# EasyEDA schematic SCH_μAtlas_2026-06-21.json
TITLE: PWR Management; REV: 1.0; Date: 2026-06-20; Sheet: 1/1; Drawn By: httperry; Company: HackClub - Macondo
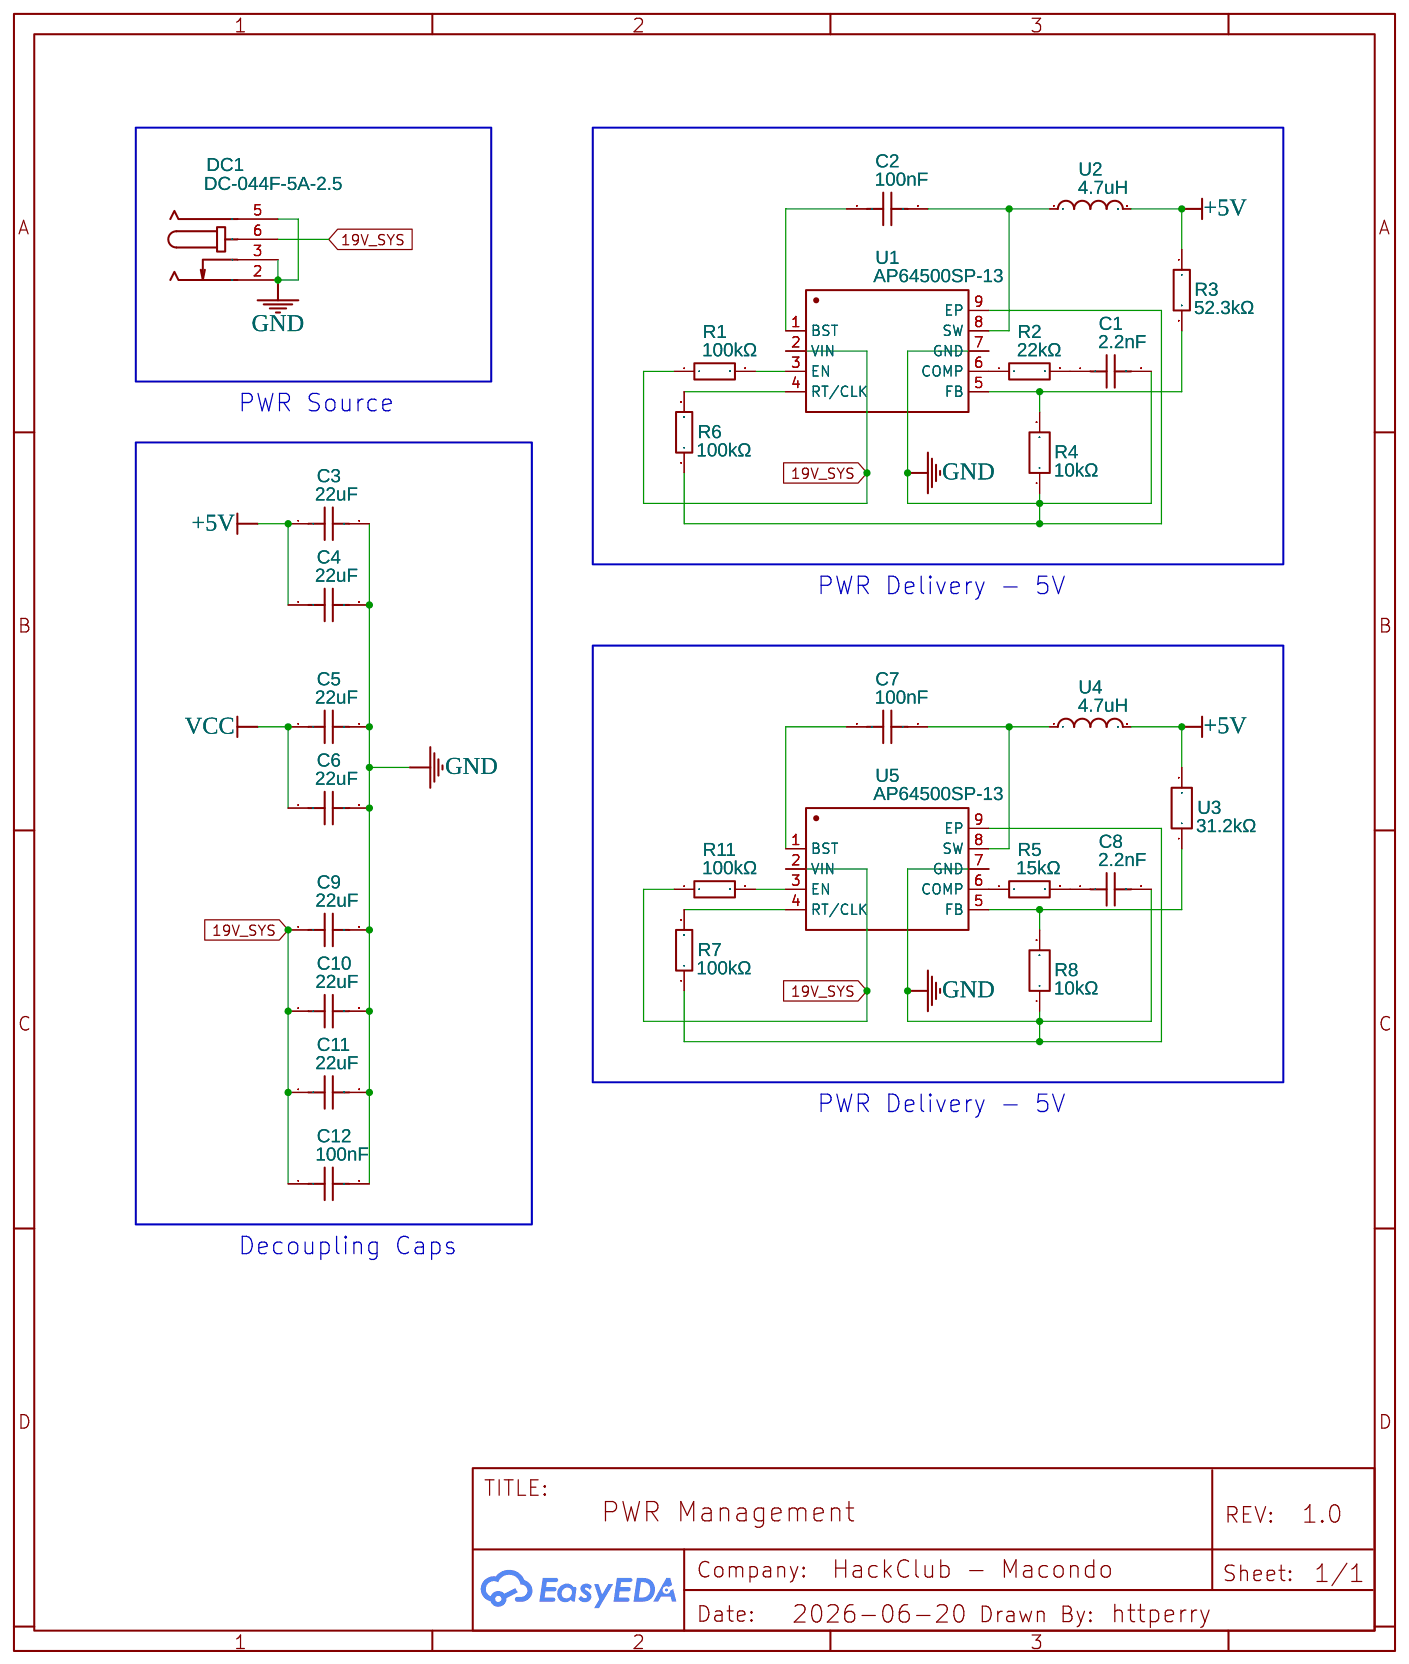
[diagram p0: schematic sheet]

## Parts
C1  2.2nF  [C0603]
C2  100nF  [C0603]
C3  22uF  [C0603]
C4  22uF  [C0603]
C5  22uF  [C0603]
C6  22uF  [C0603]
C7  100nF  [C0603]
C8  2.2nF  [C0603]
C9  22uF  [CAP-SMD_L6.1-W5.3-L]
C10  22uF  [CAP-SMD_L6.1-W5.3-L]
C11  22uF  [CAP-SMD_L6.1-W5.3-L]
C12  100nF  [C0603]
DC1  DC-044F-5A-2.5  [DC-IN-TH_DC-044F-5A-2.5]
R1  100kΩ  [R0603]
R2  22kΩ  [R0603]
R3  52.3kΩ  [R0603]
R4  10kΩ  [R0603]
R5  15kΩ  [R0603]
R6  100kΩ  [R0603]
R7  100kΩ  [R0603]
R8  10kΩ  [R0603]
R11  100kΩ  [R0603]
U1  AP64500SP-13  [SO-8_L4.9-W3.9-P1.27-LS6.0-BL-EP]
U2  4.7uH  [IND-SMD_L7.0-W6.6_APH0630]
U3  31.2kΩ  [R0603]
U4  4.7uH  [IND-SMD_L7.0-W6.6_APH0630]
U5  AP64500SP-13  [SO-8_L4.9-W3.9-P1.27-LS6.0-BL-EP]

## Library data of the parts
C1 C8 = FCC0603B222K500CT: Supplier: LCSC; Supplier Part: C5137562; Manufacturer: FOJAN(富捷); Contributor: lcsc; JLCPCB Part Class: Extended Part
C2 C7 C12 = GRM188R71H104KA93D: Supplier: LCSC; Manufacturer: muRata(村田); Supplier Part: C77055; JLCPCB Part Class: Extended Part
C3-C6 = HGC0603R5226M160NTHJ: Supplier: LCSC; Supplier Part: C22367828; Manufacturer: Chinocera(华瓷); JLCPCB Part Class: Extended Part; Contributor: lcsc
C9-C11 = KCM55QR71H226KH13K: Supplier: LCSC; Supplier Part: C6579204; Manufacturer: muRata(村田); JLCPCB Part Class: Extended Part; Contributor: lcsc
DC1 = DC-044F-5A-2.5: Supplier: LCSC; Supplier Part: C779941; Manufacturer: XKB Connection(中国星坤); JLCPCB Part Class: Extended Part; Contributor: lcsc
R1 R6 R7 R11 = RS-03K1003FT_C115320: Contributor: LCSC; Supplier: LCSC; Manufacturer: FH(风华); Manufacturer Part: RS-03K1003FT; Supplier Part: C115320; JLCPCB Part Class: Extended Part
R2 = RS-03K2202FT: Contributor: LCSC; Supplier: LCSC; Supplier Part: C286577; Manufacturer: FH(风华); JLCPCB Part Class: Extended Part
R3 = RS-03K5232FT: Contributor: LCSC; Supplier: LCSC; Supplier Part: C304764; Manufacturer: FH(风华); JLCPCB Part Class: Extended Part
R4 R8 = AR03BTS1002: Supplier: LCSC; Supplier Part: C20607729; Manufacturer: Viking(光颉); JLCPCB Part Class: Extended Part; Contributor: lcsc
R5 = CR0603FA1502G: Supplier: LCSC; Manufacturer: LIZ(丽智电子); Supplier Part: C100780; JLCPCB Part Class: Extended Part
U1 U5 = AP64500SP-13: Contributor: LCSC; Supplier: LCSC; Supplier Part: C2070920; Manufacturer: DIODES(美台); JLCPCB Part Class: Extended Part
U2 U4 = APH0630T4R7M: Supplier: LCSC; Supplier Part: C5349705; Manufacturer: APV(爱普微); JLCPCB Part Class: Extended Part; Contributor: lcsc
U3 = RT0603DRE0731K2L: Supplier: LCSC; Supplier Part: C863036; Manufacturer: YAGEO(国巨); JLCPCB Part Class: Extended Part; Contributor: lcsc

## Nets
19V_SYS: C9.1 C10.1 C11.1 C12.1 DC1.6 R1.1 R11.1 U1.2(VIN) U5.2(VIN)
+5V: C3.1 C4.1 R3.1 U2.2 U3.2 U4.2
GND: C1.2 C3.2 C4.2 C5.2 C6.2 C8.2 C9.2 C10.2 C11.2 C12.2 DC1.2 DC1.3 DC1.5 R4.1 R6.1 R7.1 R8.1 U1.7(GND) U1.9(EP) U5.7(GND) U5.9(EP)
VCC: C5.1 C6.1
Net-(C1-1): C1.1 R2.2
Net-(C2-1): C2.1 U1.1(BST)
Net-(C2-2): C2.2 U1.8(SW) U2.1
Net-(C7-1): C7.1 U5.1(BST)
Net-(C7-2): C7.2 U4.1 U5.8(SW)
Net-(C8-1): C8.1 R5.2
Net-(R1-2): R1.2 U1.3(EN)
Net-(R2-1): R2.1 U1.6(COMP)
Net-(R3-2): R3.2 R4.2 U1.5(FB)
Net-(R5-1): R5.1 U5.6(COMP)
Net-(R6-2): R6.2 U1.4(RT/CLK)
Net-(R7-2): R7.2 U5.4(RT/CLK)
Net-(R8-2): R8.2 U3.1 U5.5(FB)
Net-(R11-2): R11.2 U5.3(EN)

## Notes on the sheet
- PWR Source
- PWR Delivery - 5V
- PWR Delivery - 5V
- Decoupling Caps
